# Altium schematic sheet ScienceCCD.SchDoc
size A
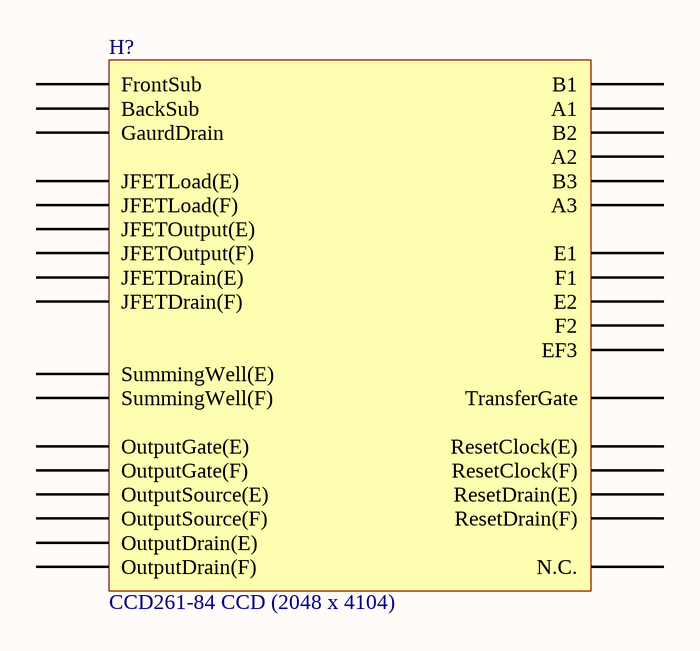
[diagram p0: ScienceCCD.SchDoc]

## Parts
H?  CCD261-84 CCD (2048 x 4104)

## Nets

Not connected (* = marked no-connect by the designer): H? 1(FrontSub) 2(BackSub) 3(GaurdDrain) 4(B1) 5(A1) 6(B2) 7(A2) 8(B3) 9(A3) 10(TransferGate) 11(SummingWell(E)) 12(OutputGate(E)) 13(ResetClock(E)) 14(ResetDrain(E)) 15(OutputSource(E)) 16(OutputDrain(E)) 17(JFETDrain(E)) 18(JFETOutput(E)) 19(JFETLoad(E)) 20(E1) 21(E2) 22(EF3) 23(F2) 24(F1) 25(SummingWell(F)) 26(OutputGate(F)) 27(ResetDrain(F)) 28(ResetClock(F)) 29(OutputDrain(F)) 30(OutputSource(F)) 31(JFETDrain(F)) 32(JFETOutput(F)) 33(JFETLoad(F)) 34(N.C.)

## Library data of the parts
H? = CCD261-84